# EAGLE board Apple ii SCSI VDEV2 (EAGLE 9.6.2), part 1 of 2
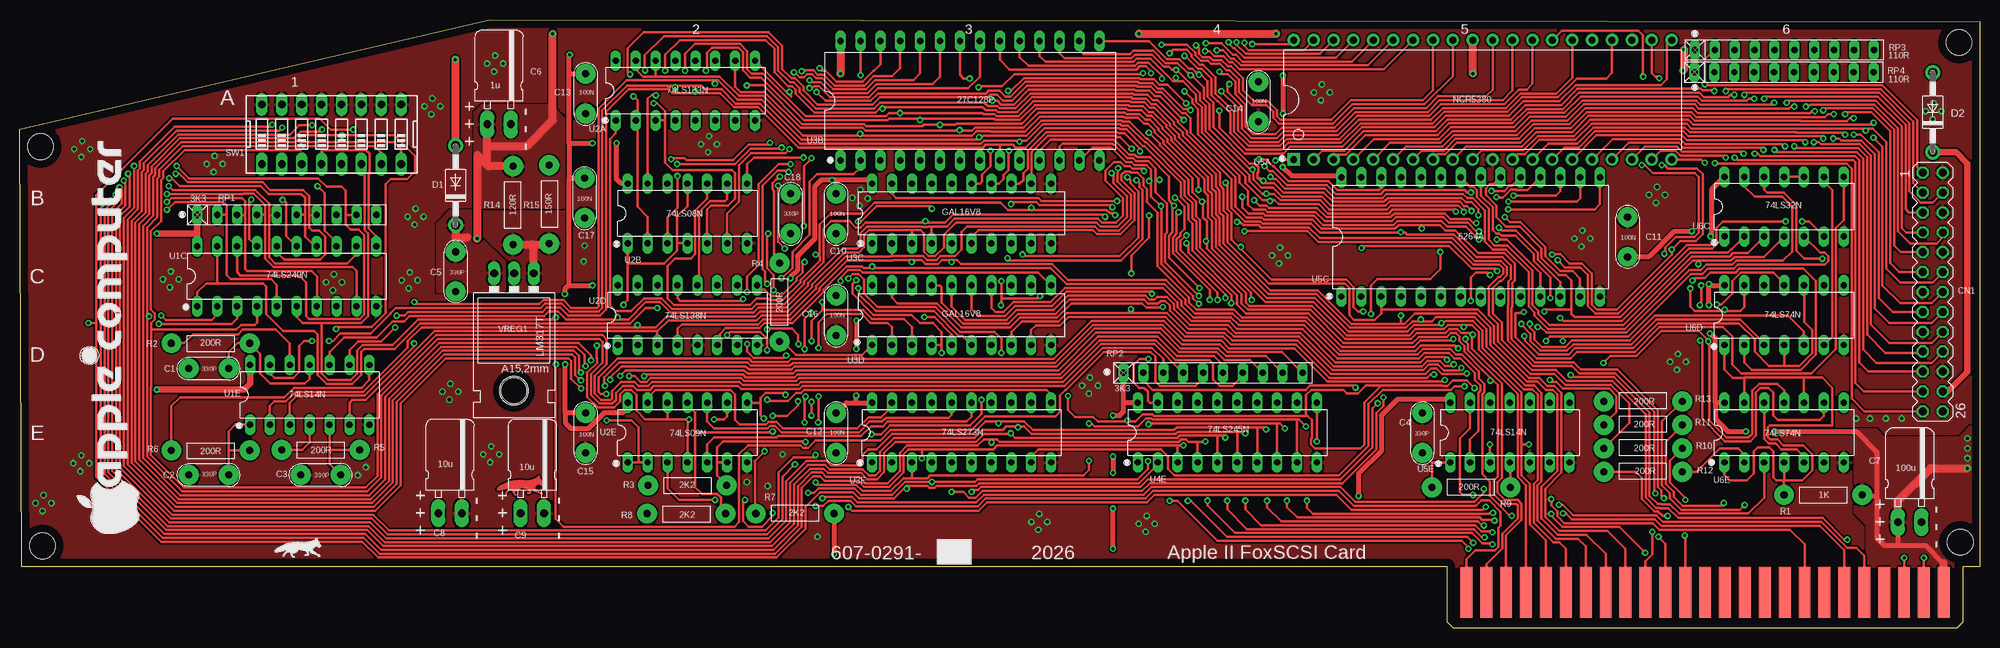
[diagram p2: board, top side]
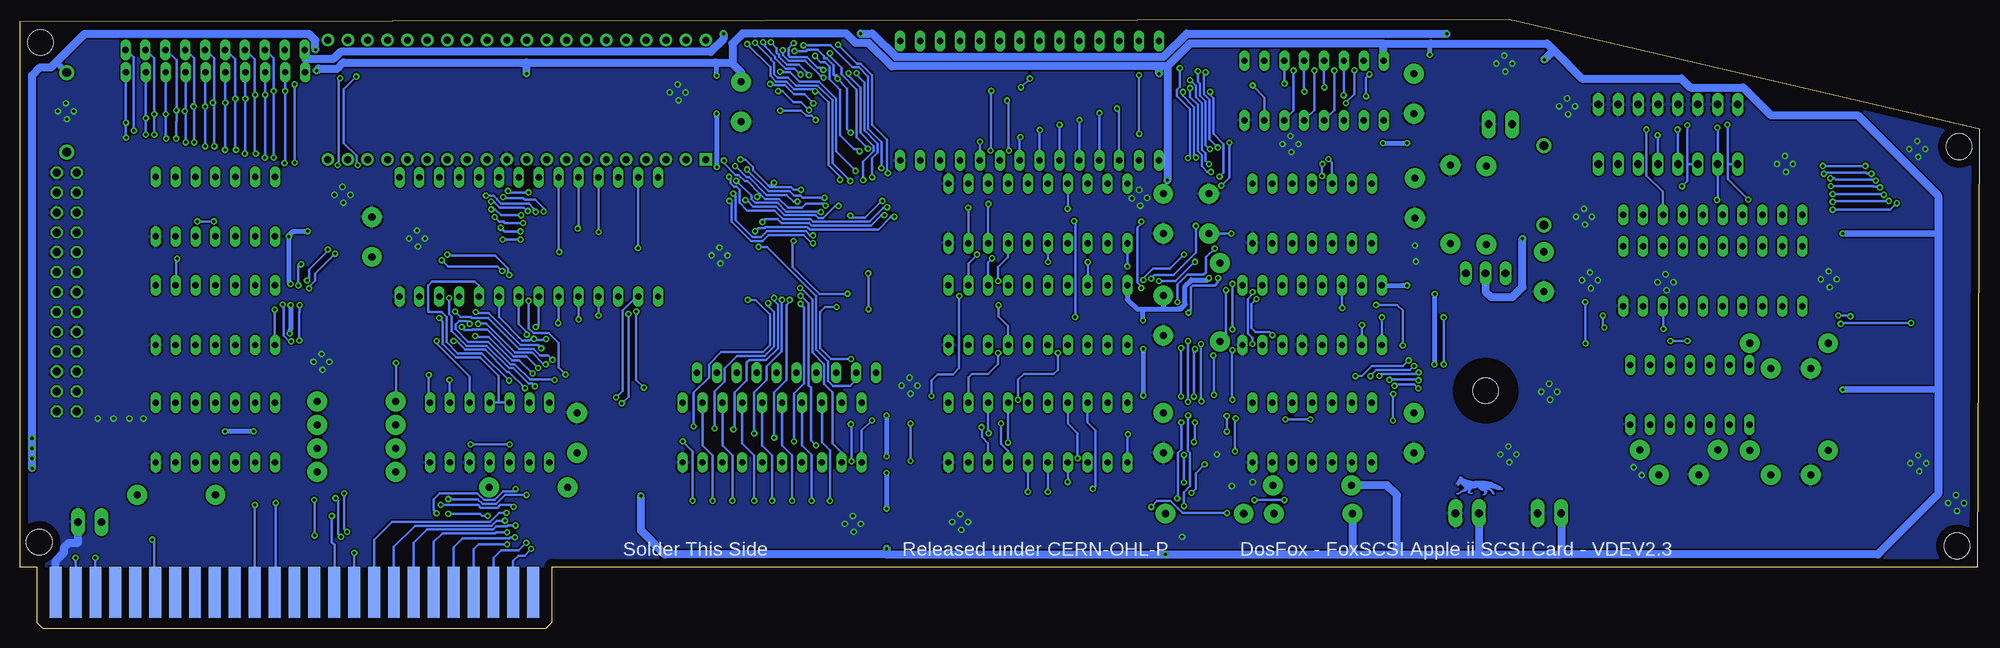
[diagram p3: board, bottom side, seen from below]

Size 250.25 x 77.75 mm. Coordinates in mm from the lower left corner, seen from the top.
Outline: 0.25,7.87 0,63.75 60,77.75 250.25,77.5 250.25,7.87 248.04,7.87 248.04,0.76 247.28,0 183.02,0 182.26,0.76 182.26,7.87 0.25,7.87
Copper layers (1*16): Top 0.035mm / dielectric 1.5mm / Bottom 0.035mm
Design rules "Fusion Electronics Design Rules *": minimum track width 8mil, minimum drill 15mil, track to track 0.187959375mm, track to pad 0.187959375mm, pad to pad 0.187959375mm, via to via 8mil, smd to smd 0.187959375mm, copper to edge 40mil, drill to drill 8mil, minimum pad ring 10mil, minimum via ring 8mil, stop-mask expansion 4mil, vias tented up to drill 15mil, thermal gap 10mil
Net classes: 1 thick: width 0.381 mm
Holes 3.3 mm at 2.68,61.53 2.92,10.54 247.59,74.84 247.75,11

## Footprints (pad centres in the part's own frame; a part is rotated, then mirrored left to right if it is on the bottom)
CAP_5.08MM_PITCH = drill 0.9 pad 2.54: P$1 0,0; P$2 0,-5.08
CAP_ELECTROLYTIC_FLAT = drill 1 pad 1.778 long: P$1 0,0; P$2 0,-3
MA13-2 = drill 1.016 octagon: 1 -15.24,-1.27; 2 -15.24,1.27; 3 -12.7,-1.27; 4 -12.7,1.27; 5 -10.16,-1.27; 6 -10.16,1.27; 7 -7.62,-1.27; 8 -7.62,1.27; 9 -5.08,-1.27; 10 -5.08,1.27; 11 -2.54,-1.27; 12 -2.54,1.27; 13 0,-1.27; 14 0,1.27; 15 2.54,-1.27; 16 2.54,1.27; 17 5.08,-1.27; 18 5.08,1.27; 19 7.62,-1.27; 20 7.62,1.27; 21 10.16,-1.27; 22 10.16,1.27; 23 12.7,-1.27; 24 12.7,1.27; 25 15.24,-1.27; 26 15.24,1.27
DO41-10 = drill 1.118 pad 1.93: A 5.08,0; C -5.08,0
RESISTORTHRUHOLE = drill 0.9 pad 2.54: P$1 0,0; P$2 10,0
RN-10 = drill 0.813 long: 1 -11.43,0; 2 -8.89,0; 3 -6.35,0; 4 -3.81,0; 5 -1.27,0; 6 1.27,0; 7 3.81,0; 8 6.35,0; 9 8.89,0; 10 11.43,0
A2-50PIN-MINI = smd 1.524 x 6.477: 01 27.435,-29.845; 02 29.975,-29.845; 03 32.515,-29.845; 04 35.055,-29.845; 05 37.595,-29.845; 06 40.135,-29.845; 07 42.675,-29.845; 08 45.215,-29.845; 09 47.755,-29.845; 10 50.295,-29.845; 11 52.835,-29.845; 12 55.375,-29.845; 13 57.915,-29.845; 14 60.455,-29.845; 15 62.995,-29.845; 16 65.535,-29.845; 17 68.075,-29.845; 18 70.615,-29.845; 19 73.155,-29.845; 20 75.695,-29.845; 21 78.235,-29.845; 22 80.775,-29.845; 23 83.315,-29.845; 24 85.855,-29.845; 25 88.395,-29.845 | smd 1.524 x 6.477 bottom: 26 88.395,-29.845; 27 85.855,-29.845; 28 83.315,-29.845; 29 80.775,-29.845; 30 78.235,-29.845; 31 75.695,-29.845; 32 73.155,-29.845; 33 70.615,-29.845; 34 68.075,-29.845; 35 65.535,-29.845; 36 62.995,-29.845; 37 60.455,-29.845; 38 57.915,-29.845; 39 55.375,-29.845; 40 52.835,-29.845; 41 50.295,-29.845; 42 47.755,-29.845; 43 45.215,-29.845; 44 42.675,-29.845; 45 40.135,-29.845; 46 37.595,-29.845; 47 35.055,-29.845; 48 32.515,-29.845; 49 29.975,-29.845; 50 27.435,-29.845
DIPSWITCH-08 = drill 0.97 long: 1 -8.89,-3.81; 2 -6.35,-3.81; 3 -3.81,-3.81; 4 -1.27,-3.81; 5 1.27,-3.81; 6 3.81,-3.81; 7 6.35,-3.81; 8 8.89,-3.81; 9 8.89,3.81; 10 6.35,3.81; 11 3.81,3.81; 12 1.27,3.81; 13 -1.27,3.81; 14 -3.81,3.81; 15 -6.35,3.81; 16 -8.89,3.81
DIL20 = drill 0.813 long: 1 -11.43,-3.81; 2 -8.89,-3.81; 3 -6.35,-3.81; 4 -3.81,-3.81; 5 -1.27,-3.81; 6 1.27,-3.81; 7 3.81,-3.81; 8 6.35,-3.81; 9 8.89,-3.81; 10 11.43,-3.81; 11 11.43,3.81; 12 8.89,3.81; 13 6.35,3.81; 14 3.81,3.81; 15 1.27,3.81; 16 -1.27,3.81; 17 -3.81,3.81; 18 -6.35,3.81; 19 -8.89,3.81; 20 -11.43,3.81
DIL14 = drill 0.813 long: 1 -7.62,-3.81; 2 -5.08,-3.81; 3 -2.54,-3.81; 4 0,-3.81; 5 2.54,-3.81; 6 5.08,-3.81; 7 7.62,-3.81; 8 7.62,3.81; 9 5.08,3.81; 10 2.54,3.81; 11 0,3.81; 12 -2.54,3.81; 13 -5.08,3.81; 14 -7.62,3.81
DIL16 = drill 0.813 long: 1 -8.89,-3.81; 2 -6.35,-3.81; 3 -3.81,-3.81; 4 -1.27,-3.81; 5 1.27,-3.81; 6 3.81,-3.81; 7 6.35,-3.81; 8 8.89,-3.81; 9 8.89,3.81; 10 6.35,3.81; 11 3.81,3.81; 12 1.27,3.81; 13 -1.27,3.81; 14 -3.81,3.81; 15 -6.35,3.81; 16 -8.89,3.81
DIL28-6 = drill 0.813 long: 1 -16.51,-7.62; 2 -13.97,-7.62; 3 -11.43,-7.62; 4 -8.89,-7.62; 5 -6.35,-7.62; 6 -3.81,-7.62; 7 -1.27,-7.62; 8 1.27,-7.62; 9 3.81,-7.62; 10 6.35,-7.62; 11 8.89,-7.62; 12 11.43,-7.62; 13 13.97,-7.62; 14 16.51,-7.62; 15 16.51,7.62; 16 13.97,7.62; 17 11.43,7.62; 18 8.89,7.62; 19 6.35,7.62; 20 3.81,7.62; 21 1.27,7.62; 22 -1.27,7.62; 23 -3.81,7.62; 24 -6.35,7.62; 25 -8.89,7.62; 26 -11.43,7.62; 27 -13.97,7.62; 28 -16.51,7.62
DIP40 = drill 0.889 pad 1.6 square: 1 -22.86,-7.62 | drill 0.889 pad 1.6: 2 -20.32,-7.62; 3 -17.78,-7.62; 4 -15.24,-7.62; 5 -12.7,-7.62; 6 -10.16,-7.62; 7 -7.62,-7.62; 8 -5.08,-7.62; 9 -2.54,-7.62; 10 0,-7.62; 11 2.54,-7.62; 12 5.08,-7.62; 13 7.62,-7.62; 14 10.16,-7.62; 15 12.7,-7.62; 16 15.24,-7.62; 17 17.78,-7.62; 18 20.32,-7.62; 19 22.86,-7.62; 20 25.4,-7.62; 21 25.4,7.62; 22 22.86,7.62; 23 20.32,7.62; 24 17.78,7.62; 25 15.24,7.62; 26 12.7,7.62; 27 10.16,7.62; 28 7.62,7.62; 29 5.08,7.62; 30 2.54,7.62; 31 0,7.62; 32 -2.54,7.62; 33 -5.08,7.62; 34 -7.62,7.62; 35 -10.16,7.62; 36 -12.7,7.62; 37 -15.24,7.62; 38 -17.78,7.62; 39 -20.32,7.62; 40 -22.86,7.62
317TL = drill 1.016 long: 1 -2.54,-3.81; 2 0,-3.81; 3 2.54,-3.81 | hole 3.302: 0,11.176

## Placement (x,y rotation side)
C1  330p 100V  [CAP_5.08MM_PITCH]  21.61,33.17 90 top
C2  330p 100V  [CAP_5.08MM_PITCH]  21.61,19.59 90 top
C3  330p 100V  [CAP_5.08MM_PITCH]  35.91,19.59 90 top
C4  330p 100V  [CAP_5.08MM_PITCH]  179.1,27.5 0 top
C5  330p 50V  [CAP_5.08MM_PITCH]  55.69,43.01 180 top
C6  1u 50V  [CAP_ELECTROLYTIC_FLAT]  59.71,64.38 90 top
C7  3102-100U  [CAP_ELECTROLYTIC_FLAT]  239.8,13.57 90 top
C8  [CAP_ELECTROLYTIC_FLAT]  53.45,14.7 90 top
C9  [CAP_ELECTROLYTIC_FLAT]  63.95,14.7 90 top
C10  100n 50V  [CAP_5.08MM_PITCH]  104.25,55.5 0 top
C11  100n 50V  [CAP_5.08MM_PITCH]  205.28,47.45 180 top
C12  100n 50V  [CAP_5.08MM_PITCH]  104.25,27.5 0 top
C13  100n 50V  [CAP_5.08MM_PITCH]  72.25,70.82 0 top
C14  100n 50V  [CAP_5.08MM_PITCH]  158.13,69.79 0 top
C15  100n 50V  [CAP_5.08MM_PITCH]  72.25,27.5 0 top
C16  100n 50V  [CAP_5.08MM_PITCH]  104.25,42.5 0 top
C17  100n 50V  [CAP_5.08MM_PITCH]  72.13,57.5 0 top
C18  330p 100V  [CAP_5.08MM_PITCH]  98.44,55.5 0 top
CN1  [MA13-2]  244.25,42.96 270 top
D1  1N4004  [DO41-10]  55.66,56.57 90 top
D2  1N4004  [DO41-10]  244.22,65.91 90 top
R1  1k  [RESISTORTHRUHOLE]  225.25,17.05 0 top
R2  200R  [RESISTORTHRUHOLE]  19.38,36.41 0 top
R3  2k2  [RESISTORTHRUHOLE]  80.25,18.28 0 top
R4  200R  [RESISTORTHRUHOLE]  97.04,46.66 270 top
R5  200R  [RESISTORTHRUHOLE]  33.43,22.79 0 top
R6  200R  [RESISTORTHRUHOLE]  19.38,22.71 0 top
R7  2k2  [RESISTORTHRUHOLE]  103.98,14.65 180 top
R8  2k2  [RESISTORTHRUHOLE]  80.13,14.65 0 top
R9  200R  [RESISTORTHRUHOLE]  190.29,18 180 top
R10  200R  [RESISTORTHRUHOLE]  212.25,23 180 top
R11  200R  [RESISTORTHRUHOLE]  212.25,26 180 top
R12  200R  [RESISTORTHRUHOLE]  212.25,20 180 top
R13  200R  [RESISTORTHRUHOLE]  212.25,29 180 top
R14  120R  [RESISTORTHRUHOLE]  62.99,59.03 270 top
R15  150R  [RESISTORTHRUHOLE]  67.61,49.16 90 top
RP1  3K3  [RN-10]  34.11,52.81 0 top
RP2  3K3  [RN-10]  152.35,32.63 0 top
RP3  100R  [RN-10]  225.3,73.87 0 top
RP4  100R  [RN-10]  225.25,71.04 0 top
ST1  [A2-50PIN-MINI]  157.25,34.45 0 top
SW1  [DIPSWITCH-08]  39.83,63.1 0 top
U1C  74LS240N  [DIL20]  34.11,44.97 0 top
U1E  74LS14N  [DIL14]  37.03,29.83 0 top
U2A  74LS133N  [DIL16]  85,68.69 0 top
U2B  74LS08N  [DIL14]  85.25,53 0 top
U2D  74LS138N  [DIL16]  85.25,40 0 top
U2E  74LS09N  [DIL14]  85.25,25 0 top
U3B  27C128P  [DIL28-6]  121.32,67.38 0 top
U3C  GAL16V8  [DIL20]  120.25,53 0 top
U3D  GAL16V8  [DIL20]  120.25,40 0 top
U3E  74LS273N  [DIL20]  120.25,25 0 top
U4E  74LS245N  [DIL20]  154.19,25 0 top
U5A  NCR5380  [DIP40]  185.51,67.5 0 top
U5C  6264A  [DIL28-6]  185.25,50 0 top
U5E  74LS14N  [DIL14]  190.25,25 0 top
U6C  74LS32N  [DIL14]  225.25,53.86 0 top
U6D  74LS74N  [DIL14]  225.25,40 0 top
U6E  74LS74N  [DIL14]  225.25,25 0 top
VREG1  LM317T  [317TL]  63.11,41.54 180 top

## Tracks (layer width: path | path; a pad name or v marks a point on that pad's centre or on a via)
00  (via drill 0.38 pad 0.8)
  Top 0.305: R12.P$2 206.31,20 207.07,19.25 207.07,16.55 208.7,14.91 209.14,14.91 209.21,14.84 209.25,14.84 209.75,14.35 v210.4,14.35
  Bottom 0.305: ST1.40 210.06,4.64 210.06,10.67 210.4,11.01 v210.4,14.35
7M  (via drill 0.38 pad 0.8)
  Top 0.305: R13.P$1 209.66,26.4 209.66,18.24 210.68,17.22 210.68,16.59 212.12,15.15 219.62,15.15 v220.22,15.75
  Bottom 0.305: v220.22,15.75 220.22,2.92 220.34,2.79 220.34,4.51 ST1.36
+2V85  (via drill 0.38, 0.38 pad 0.8)
  Top 1.016: 59.71,59.18 59.71,61.47 | 59.71,61.47 C6.P$1 | R14.P$1 59.86,59.03 59.71,59.18 | 59.71,59.18 58.44,60.45 58.44,49.8 v58.4,49.76 | 59.71,61.47 59.84,61.59 64.77,61.59 68.07,64.9 v68.07,75.95 | RP3.1 213.87,71.09 RP4.1 | v142.88,75.95 142.91,75.98 160.4,75.98 v160.4,75.95
  Bottom 1.016: v68.07,75.95 69.6,75.95 101.25,75.98 104.25,72.98 138.39,72.98 141.38,75.98 142.84,75.98 v142.88,75.95 | RP3.1 213.84,73.84 213.84,72.82 213.73,72.71 210.19,72.71 209.28,73.62 162.03,73.62 160.4,75.25 v160.4,75.95 | VREG1.2 63.11,43.04 62.36,42.29 59.69,42.29 58.4,43.58 v58.4,49.76
  pour Top: 58.12,53.8 69.77,53.8 69.77,64.87 67.91,66.73 58.96,66.73 58.12,65.88
+5V  (via drill 0.38, 0.38 pad 0.8, 0.4 pad 0.8)
  Top 0.61: 239.78,10.54 238.12,10.54 237.11,11.56 237.11,16.89 | C7.P$1 239.8,10.56 239.78,10.54 | 239.78,10.54 243.39,10.54 245.6,8.33 | v139.57,10.18 v139.57,15.29 | 215.77,43.81 215.66,43.81 v215.66,41.27 | 215.77,43.81 U6D.14 | U6E.14 216.48,28.81 | 216.48,28.81 216.48,26.72 218.06,25.15 v220.4,25.15 | v224.03,25.15 234.44,25.15 237.11,22.48 237.11,16.89 | R1.P$2 235.41,16.89 237.11,16.89 | 70.14,57.5 C17.P$1 | U2B.14 76.79,56.81 76.2,57.4 v76.2,61.98 | 70.14,43.89 70.14,43.81 v73.13,43.81 | 70.14,43.89 70.14,57.5 | 70.14,61.98 70.14,57.5 | 70.14,61.98 70.14,70.82 | 70.14,70.82 C13.P$1 | U2E.14 77.63,28.18 77.02,27.56 74.66,27.56 72.63,25.53 70.36,25.53 69.65,26.24 69.65,27.56 | v139.57,27.18 140.42,27.18 140.92,27.68 140.92,28.83 | 140.92,28.83 RP2.1 | 69.65,27.56 v69.65,33.73 | U5E.14 182.18,29.26 175.91,29.26 173.83,27.18 173.83,22.61 170.94,19.73 v170.94,16.89 | v139.57,21.97 v139.57,19.84 | 216.48,28.81 216.48,37.04 215.85,37.67 v215.77,37.67 | 215.77,43.81 215.77,43.87 v215.67,43.97 | U6C.14 215.99,56.02 215.99,50.17 v215.88,50.06 | 70.14,70.82 70.14,73.19 v70.23,73.28 | 70.14,61.98 v73.13,61.98 | 70.14,43.89 69.6,43.34 v69.6,42.71 | U3C.20 108.4,57.24 104.27,57.24 | 104.27,57.24 v103.74,57.24 102.34,57.24 101.51,56.4 101.51,49.73 99.29,47.52 99.29,45.72 98.44,44.87 v98.44,44.71 | C11.P$1 207.98,47.45 211.2,50.67 213.45,50.67 v213.49,50.71 | U5C.28 168.59,57.78 162.39,57.78 v161.25,58.93 | C15.P$1 69.71,27.5 69.65,27.56 | v161.29,70.61 v161.29,65.72 | R7.P$1 v103.98,9.45 | C12.P$1 105.56,28.81 106.81,28.81 | 106.81,28.81 U3E.20 | 106.81,28.81 v106.81,29.72 | v106.85,39.32 106.83,39.3 106.83,35.71 v106.81,35.69
  Top 0.61: U4E.20 140.94,28.81 140.92,28.83 | C10.P$1 104.25,57.22 104.27,57.24
  Top 0.813: RP1.1 22.68,50.42 | 22.68,50.42 U1C.20 | 22.68,50.42 v17.53,50.42 | U1E.14 29.44,33.61 29.44,31.26 28.67,30.48 v17.53,30.48
  Top 1.016: 245.6,8.33 245.6,4.66 ST1.25 | D1.A 55.66,72.61 v55.63,72.64 | C7.P$1 239.8,16.28 243.97,20.45 v248.67,20.45 | U5A.31 185.51,70.91 v185.55,70.87 | U3B.28 104.81,70.9 v104.78,70.87 | v212.34,71.25 212.46,71.36 212.46,72.26 212.47,72.27 v212.47,73.91
  Bottom 0.61: U3D.20 108.82,42.02 107.57,40.77 106.85,40.77 | 106.85,40.77 104.14,40.77 | 104.14,40.77 102.36,40.77 102.34,40.79 102.05,40.79 101.47,41.37 101.47,43.71 100.67,44.52 98.63,44.52 v98.44,44.71 | C16.P$1 104.25,40.88 104.14,40.77 | U2D.16 73.67,43.81 73.66,43.81 v73.13,43.81 | v139.57,27.18 v139.57,21.97 | v220.4,25.15 v224.03,25.15 | v69.6,42.71 69.65,42.66 v69.65,33.73 | v139.57,19.84 v139.57,15.29 | v215.77,37.67 215.77,38.03 215.66,38.14 v215.66,41.27 | v215.67,43.97 215.88,44.18 v215.88,50.06 215.88,50.19 215.39,50.67 213.53,50.67 v213.49,50.71 | v70.23,73.28 70.23,74.55 70.1,74.68 | v76.2,61.98 v73.13,61.98 | v161.25,58.93 161.25,65.36 161.29,65.41 v161.29,65.72 | v161.29,70.61 161.29,72.14 161.42,72.26 | v106.81,29.72 v106.81,35.69 | v106.85,39.32 106.85,40.77
  Bottom 0.813: v17.53,50.42 5.46,50.42 5.33,50.55 | v17.53,30.48 5.33,30.48 | 245.55,72.33 D2.A
  Bottom 1.016: v139.57,10.18 139.57,9.45 | 139.57,9.45 v103.98,9.45 80.26,9.45 | 80.26,9.45 74.42,9.45 | v170.94,16.89 170.94,12.5 167.89,9.45 139.57,9.45 | 74.42,9.45 74.42,17.02 75.68,18.28 R3.P$1 | R8.P$1 80.13,9.59 80.26,9.45 | 74.42,9.45 63.75,9.45 | 63.75,9.45 53.59,9.45 | v248.67,20.45 v248.67,21.72 v248.67,22.99 v248.67,24.26 248.67,70.61 247.61,71.66 246.22,71.66 245.55,72.33 242,75.89 213.31,75.89 212.51,75.09 212.51,73.95 v212.47,73.91 | v212.34,71.25 212.09,71.5 209.68,71.5 208.91,72.26 185.55,72.26 | 185.55,72.26 161.42,72.26 159.38,72.26 | 159.38,72.26 159.26,72.26 159.26,74.69 157.97,75.98 144.71,75.98 143.48,74.74 141.85,74.74 138.89,71.78 104.78,71.78 | 159.38,72.26 158.13,71 C14.P$1 | v185.55,70.87 185.55,72.26 | U2A.16 76.15,72.54 76.15,74.68 | 76.15,74.68 100.85,74.68 103.75,71.78 | 103.75,71.78 104.78,71.78 | v104.78,70.87 104.78,71.78 | 76.15,74.68 70.1,74.68 55.24,74.68 54.36,73.79 | 54.36,73.79 50.8,70.23 38.1,70.23 36.95,69.08 30.22,69.08 26.67,65.53 15.62,65.53 5.33,55.24 5.33,50.55 5.33,30.48 5.33,17.14 13.03,9.45 53.59,9.45 | v55.63,72.64 54.48,73.79 54.36,73.79 | 103.75,71.78 103.75,59.69 | 103.75,59.69 103.75,57.25 v103.74,57.24 | 103.75,59.69 103.82,59.76 U3B.1 | C9.P$1 63.95,9.65 63.75,9.45 | 53.59,9.45 53.45,9.59 C8.P$1
  pour Top: 235.76,13.27 235.79,13.2 235.79,7.93 250.11,7.93 250.11,25.96 249.21,25.96 247.59,24.34 247.51,24.31 238.14,24.31 238.06,24.34 237.08,25.32 234.26,25.32 234.26,19.96 234.26,19.92 234.26,19.92 234.26,19.92 234.25,19.9 234.25,14.78
/ACK  (via drill 0.38 pad 0.8)
  Top 0.305: v230.24,66.16 230.5,66.42 236.58,66.42 239.29,63.71 239.29,48.87 240.13,48.04 CN1.9 | v230.25,62.57 229.99,62.83 226.61,62.83 226.6,62.85 213.03,62.85 212.4,63.48 201.11,63.48 199.04,61.41 197.2,61.41 U5A.14
  Bottom 0.305: 230.2,66.16 230.2,64.69 230.25,64.64 v230.25,62.57 | 230.2,66.16 v230.24,66.16 | RP3.8 231.53,73.87 230.2,72.54 230.2,66.16
/ATN  (via drill 0.38 pad 0.8)
  Top 0.305: CN1.8 245.52,49.94 244.73,49.15 241.36,49.15 239.79,50.73 239.79,63.91 236.79,66.92 228.61,66.92 228.35,66.65 v228.05,66.65 | v227.97,62.08 227.7,62.34 226.41,62.34 226.39,62.36 212.83,62.36 212.2,62.99 201.32,62.99 U5A.15
  Bottom 0.305: 227.97,66.61 227.97,72.85 228.99,73.87 RP3.7 | 227.97,66.61 v227.97,62.08 | 227.97,66.61 228,66.65 v228.05,66.65
/BSY  (via drill 0.38 pad 0.8)
  Top 0.305: v233.04,65.67 233.31,65.93 236.38,65.93 238.8,63.51 238.8,46.63 239.93,45.5 CN1.11 | U5A.13 195.15,61.91 198.84,61.91 200.91,63.98 212.6,63.98 213.24,63.34 226.8,63.34 226.82,63.33 232.78,63.33 v233.04,63.06
  Bottom 0.305: RP3.9 234.07,73.87 233.04,72.85 v233.04,65.67 233.04,63.54 v233.04,63.06
/CD  (via drill 0.38 pad 0.8)
  Top 0.305: CN1.4 244.22,54.36 242.72,54.36 241.27,55.81 241.27,64.53 237.4,68.39 220.43,68.39 v220.17,68.13 | v220.09,60.62 219.83,60.88 212.22,60.88 211.58,61.51 207.46,61.51 U5A.18
  Bottom 0.305: 220.22,68.42 220.22,72.72 221.37,73.87 RP3.4 | 220.22,68.42 220.22,60.74 v220.09,60.62 | 220.22,68.42 220.17,68.36 v220.17,68.13
/DB0  (via drill 0.38 pad 0.8)
  Top 0.305: v234.14,65.17 233.62,65.17 233.25,64.81 227.43,64.81 227.41,64.82 213.85,64.82 213.22,65.45 200.3,65.45 198.23,63.38 193.62,63.38 191.78,61.54 184.63,61.54 U5A.9 | CN1.15 239.11,40.42 237.32,42.21 237.32,60.8 235.06,63.06 v234.16,63.06
  Bottom 0.305: RP4.9 v234.14,65.17 234.14,63.64 234.16,63.61 v234.16,63.06
/DB1  (via drill 0.38 pad 0.8)
  Top 0.305: CN1.16 244.09,38.99 238.69,38.99 236.83,40.85 236.83,60.59 235.12,62.31 232.55,62.31 232.28,62.57 v231.52,62.57 | v231.6,65.66 230.81,65.66 230.45,65.3 227.64,65.3 227.62,65.31 214.05,65.31 213.42,65.95 200.09,65.95 198.02,63.88 193.42,63.88 191.58,62.03 183.51,62.03 182.01,60.54 181.09,60.54 U5A.8
  Bottom 0.305: RP4.8 v231.6,65.66 231.6,63.03 231.52,62.96 v231.52,62.57
/DB2  (via drill 0.38 pad 0.8)
  Top 0.305: CN1.18 244.09,36.45 238.7,36.45 236.34,38.81 236.34,60.39 234.91,61.81 229.94,61.81 229.67,62.08 v229.04,62.08 | v229.17,66.05 228.82,66.05 228.57,65.81 214.26,65.81 213.63,66.44 199.89,66.44 197.82,64.37 193.22,64.37 191.37,62.52 183.3,62.52 181.81,61.03 179.04,61.03 U5A.7
  Bottom 0.305: 229.06,66.17 RP4.7 | 229.06,66.17 229.06,62.91 229.04,62.9 v229.04,62.08 | 229.06,66.17 v229.17,66.05
/DB3  (via drill 0.38 pad 0.8)
  Top 0.305: CN1.19 242.82,35.18 238.18,35.18 235.85,37.52 235.85,60.19 234.73,61.3 226.83,61.3 v226.57,61.57 | v226.57,66.65 226.15,66.65 225.89,66.39 214.37,66.39 213.83,66.93 199.69,66.93 197.61,64.86 193.01,64.86 191.17,63.02 183.1,63.02 181.6,61.52 176.99,61.52 U5A.6
  Bottom 0.305: RP4.6 226.57,70.99 v226.57,66.65 v226.57,61.57
/DB4  (via drill 0.38 pad 0.8)
  Top 0.305: CN1.20 244.09,33.91 237.05,33.91 235.35,35.6 235.35,59.98 234.53,60.81 224.33,60.81 v224.03,61.11 | v223.98,67.14 223.71,66.88 214.58,66.88 214.03,67.43 199.48,67.43 197.41,65.35 192.81,65.35 190.96,63.51 182.89,63.51 181.4,62.02 174.94,62.02 U5A.5
  Bottom 0.305: RP4.5 v223.98,67.14 223.98,61.16 v224.03,61.11
/DB5  (via drill 0.38 pad 0.8)
  Top 0.305: v221.49,60.62 221.89,60.62 222.19,60.31 234.32,60.31 234.86,59.78 234.86,33.96 236.02,32.8 CN1.21 | v221.44,67.64 220.74,67.64 220.48,67.38 214.78,67.38 214.24,67.92 199.28,67.92 197.21,65.85 192.6,65.85 190.76,64 182.69,64 181.2,62.51 172.9,62.51 U5A.4
  Bottom 0.305: RP4.4 v221.44,67.64 221.44,60.67 v221.49,60.62
/DB6  (via drill 0.38 pad 0.8)
  Top 0.305: v218.95,60.12 219.03,60.12 219.33,59.82 234.12,59.82 234.37,59.57 234.37,31.34 235.45,30.26 CN1.23 | v218.9,68.13 218.38,68.13 218.12,67.87 214.99,67.87 214.44,68.41 199.07,68.41 197,66.34 192.4,66.34 190.56,64.5 182.49,64.5 180.99,63 171.78,63 169.3,60.53 168.38,60.53 U5A.3
  Bottom 0.305: RP4.3 v218.9,68.13 218.9,60.37 218.95,60.31 v218.95,60.12
/DB7  (via drill 0.38 pad 0.8)
  Top 0.305: v216.36,68.62 216.27,68.71 214.84,68.71 214.65,68.91 198.87,68.91 196.8,66.83 192.2,66.83 190.35,64.99 182.28,64.99 180.79,63.49 171.57,63.49 169.1,61.02 166.33,61.02 U5A.2 | v216.43,59.43 216.54,59.33 233.29,59.33 233.88,58.74 233.88,29.36 235.52,27.72 CN1.25
  Bottom 0.305: RP4.2 v216.36,68.62 216.36,59.51 v216.43,59.43
/DBP  (via drill 0.38 pad 0.8)
  Top 0.305: CN1.14 244.09,41.53 240.09,41.53 237.82,43.81 237.82,61.52 v236.66,62.67 | U5A.10 186.67,61.05 191.98,61.05 193.83,62.89 198.43,62.89 200.5,64.96 213.01,64.96 213.65,64.33 227.21,64.33 227.23,64.31 236.42,64.31 v236.68,64.56
  Bottom 0.305: 236.68,64.26 RP4.10 | 236.68,64.26 236.68,62.69 v236.66,62.67 | v236.68,64.56 236.68,64.26
/DEVSEL  (via drill 0.38 pad 0.8)
  Top 0.305: U2D.4 83.98,38.27 84.55,38.84 94.29,38.84 94.92,39.47 98.44,39.47 102.15,43.17 102.15,43.49 105.64,46.98 111.43,46.98 111.49,47.04 113.92,47.04 | v190.49,14.36 190.26,14.36 187.7,16.93 187.7,18.72 186.71,19.7 186.71,29.89 187,30.17 187,31.2 186.27,31.93 186.27,32.81 184.11,34.97 183.37,34.97 182.69,35.66 179.12,35.66 178.41,34.95 168.41,34.95 164.14,39.22 155.84,39.22 154.85,40.21 150.03,40.21 148.82,41.42 148.82,42.03 146.37,44.47 133.84,44.47 131.8,46.51 120.19,46.51 119.66,47.04 118.96,47.04 | 113.92,47.04 115.13,47.04 115.62,46.54 117.27,46.54 117.76,47.04 118.96,47.04 | 118.96,47.04 v118.96,46.77 | v195.53,14.61 195.53,14.36 196.95,12.94 204.23,12.94 v207.52,9.65 | v113.89,46.77 113.89,47 113.92,47.04
  Bottom 0.305: v207.52,9.65 207.52,4.64 ST1.41 | v190.49,14.36 191.22,14.36 191.47,14.61 v195.53,14.61 | U3C.5 118.98,47.24 118.96,47.21 v118.96,46.77 | U3D.18 113.9,43.74 113.89,43.73 v113.89,46.77
/IO  (via drill 0.38 pad 0.8)
  Top 0.305: v222.63,61.11 222.37,61.37 212.42,61.37 211.79,62.01 205.41,62.01 U5A.17 | v222.71,67.64 222.71,67.81 222.8,67.9 237.19,67.9 240.77,64.32 240.77,53.55 241.2,53.12 CN1.5
  Bottom 0.305: 222.71,67.77 222.71,72.67 223.91,73.87 RP3.5 | 222.71,67.77 222.71,61.19 v222.63,61.11 | v222.71,67.64 222.71,67.77
/IOSELECT  (via drill 0.38, 0.38 pad 0.8)
  Top 0.305: ST1.01 184.69,8.82 185.85,9.98 188.34,9.98 188.78,10.43 188.78,12.82 189.05,13.1 189.05,14.87 187.6,16.32 186.62,16.32 185.94,15.64 170.35,15.64 168.43,17.56 144.69,17.56 143.7,16.57 123.32,16.57 122.33,15.59 106.78,15.59 106.06,16.3 103.26,16.3 102.57,15.62 v101.62,15.62 | U3D.3 113.9,38.5 112.88,39.52 108.83,39.52 107.68,40.67 102.51,40.67 | v101.1,28.95 101.1,27.2 v101.08,27.18 | 102.51,40.67 102.48,40.67 101.09,39.28 v101.09,36.68 | v95.8,62.04 95.54,61.78 93.09,61.78 91.11,59.8 85.13,59.8 84.86,60.07 83.3,60.07 v83.17,59.94 | v96.85,56.55 96.85,56.43 96.83,56.41 96.83,49.39 v97.69,48.52 | v102.42,41.69 102.51,41.6 102.51,40.67
  Bottom 0.305: v101.08,27.18 101.09,27.16 101.09,22.68 100.84,22.43 100.84,18.17 101.62,17.39 v101.62,15.62 | v101.09,36.68 101.1,36.67 v101.1,28.95 | v95.8,62.04 95.81,62.03 95.81,57.6 v96.85,56.55 | v83.17,59.94 82.71,59.49 U2B.12 | v102.42,41.69 102.42,43.91 101.17,45.16 99.11,45.16 98.81,45.47 98.81,47.4 v97.69,48.52
/IOSTROBE  (via drill 0.38 pad 0.8)
  Top 0.305: v101.98,29.61 101.98,26.32 v101.95,26.29 | ST1.20 232.95,9.94 229.79,13.1 209.56,13.1 208.73,13.92 198.17,13.92 197.41,14.68 v197.04,14.68 | v186.94,17.79 186.94,17.34 185.74,16.14 170.55,16.14 168.64,18.05 144.48,18.05 143.5,17.07 123.11,17.07 122.13,16.08 106.98,16.08 106.26,16.8 102.68,16.8 v102.49,16.61 | v101.97,35.8 101.97,39.06 103.03,40.13 107.53,40.13 108.62,39.03 110.81,39.03 111.36,38.48 U3D.2
  Bottom 0.305: v101.95,26.29 101.95,22.84 102.36,22.43 102.36,16.74 v102.49,16.61 | v101.98,29.61 101.98,35.79 v101.97,35.8 | v186.94,17.79 187.21,17.52 188.5,17.52 189.63,16.39 190.96,16.39 191.83,17.26 196.62,17.26 197.38,16.5 197.38,15.09 197.04,14.75 v197.04,14.68
/MSG  (via drill 0.38 pad 0.8)
  Top 0.305: CN1.3 241.76,56.88 241.76,64.73 237.6,68.89 218.07,68.89 v217.8,68.62 | v217.8,60.12 217.54,60.39 212.01,60.39 211.38,61.02 209.51,61.02 U5A.19
  Bottom 0.305: v217.8,60.12 v217.8,68.62 217.8,72.85 218.83,73.87 RP3.3
/REQ  (via drill 0.38 pad 0.8)
  Top 0.305: CN1.1 242.25,58.93 242.25,64.94 237.81,69.38 215.96,69.38 215.92,69.34 215.14,69.34 v215.14,69.46 | v215.14,69.46 215.14,72.72 216.29,73.87 RP3.2 | U5A.20 214.69,59.88 215.08,59.49 v215.14,59.49 | v215.14,69.46 v215.15,69.47
  Bottom 0.305: v215.15,69.47 v215.14,69.46 v215.14,59.49
/RESET  (via drill 0.38 pad 0.8)
  Top 0.305: U2B.10 87.79,54.9 86.26,53.36 86.26,47.77 85.73,47.24 83.69,47.24 82.73,46.28 82.73,42.1 83.53,41.3 93.27,41.3 94.07,42.1 95.58,42.1 95.75,41.93 97.42,41.93 99.68,44.19 99.68,44.51 102.16,46.98 102.16,47.45 102.15,47.45 102.15,47.75 | 129.16,53.45 v129.16,53.72 | 129.16,53.45 126.18,53.45 125.23,54.4 109.17,54.4 107.72,52.94 103.53,52.94 102.15,51.56 102.15,47.75 | 129.16,53.45 138.76,53.45 139.18,53.03 139.6,53.03 v139.85,52.78 | v155.44,51.91 155.81,51.91 156.23,51.48 158.2,51.48 158.46,51.22 164.62,51.22 166.01,49.83 182.9,49.83 185.79,46.93 189.11,46.93 189.88,46.16 189.88,45.12 189.15,44.39 189,44.39 188.06,43.45 188.06,40.2 189.22,39.05 189.22,36.83 193.05,33 196.12,33 197.52,31.6 203.33,31.6 207.58,27.34 207.58,16.73 208.91,15.4 209.34,15.4 209.41,15.34 210.47,15.34 211.73,14.08 230.2,14.08 232.95,11.33 v233.32,11.33 | U3D.4 117.72,36.2 | 117.72,36.2 117.72,37.85 116.59,38.99 114.93,38.99 113.88,40.04 109.01,40.04 106.31,42.73 106.31,43.99 v106.81,44.48 | 117.72,36.2 v117.72,35.17 | v122.8,29.2 122.8,27.38 121.33,25.91 111.09,25.91 109.97,24.79 v108.76,24.79 | v101.6,47.73 102.13,47.73 102.15,47.75
  Bottom 0.305: U3C.9 129.14,53.56 129.16,53.58 v129.16,53.72 | ST1.31 233.04,4.7 233.04,11.05 v233.32,11.33 | v139.85,52.78 140.22,52.78 141.57,51.44 149.17,51.44 149.5,51.77 152.99,51.77 153.46,52.24 155.1,52.24 v155.44,51.91 | v101.6,47.73 103.38,45.95 105.6,45.95 106.81,44.74 v106.81,44.48 | v117.72,35.17 117.72,33.03 118.24,32.51 122.05,32.51 122.8,31.76 v122.8,29.2 | v108.76,24.79 108.82,24.73 U3E.1
/RST  (via drill 0.38 pad 0.8)
  Top 0.305: v225.57,67.14 225.84,67.41 236.99,67.41 240.28,64.12 240.28,51.12 240.82,50.58 CN1.7 | v225.39,61.56 225.3,61.56 225,61.87 212.63,61.87 211.99,62.5 203.37,62.5 U5A.16
  Bottom 0.305: 225.42,67.44 225.42,72.85 226.45,73.87 RP3.6 | 225.42,67.44 225.57,67.29 v225.57,67.14 | 225.42,67.44 225.42,61.6 v225.39,61.56
/SEL  (via drill 0.38 pad 0.8)
  Top 0.305: CN1.12 244.22,44.2 240.1,44.2 238.31,45.98 238.31,62.08 236.59,63.81 235.53,63.81 | U5A.12 191.26,60.55 192.19,60.55 194.03,62.4 198.63,62.4 200.71,64.47 212.81,64.47 213.44,63.84 227.01,63.84 227.02,63.82 235.52,63.82 235.53,63.81 | 235.53,63.81 235.66,63.68 v235.66,63.56
  Bottom 0.305: RP3.10 236.61,73.87 235.66,72.92 v235.66,63.56
A0  (via drill 0.38 pad 0.8)
  Top 0.305: 187.96,31.82 188.72,31.06 188.72,19.39 188.19,18.87 188.19,17.13 189.42,15.9 191.04,15.9 191.25,15.69 191.25,14.05 189.28,12.08 189.28,10.22 187.23,8.17 ST1.02 | U1E.13 31.95,32.56 32.54,31.98 34.91,31.98 35.69,32.76 35.69,36.07 36.32,36.7 v37.32,36.7 | v39.5,36.7 40,36.7 40.95,37.65 44.81,37.65 47.38,40.22 47.38,40.25 48.04,40.91 66.55,40.91 67.1,41.46 69.22,41.46 70.23,40.45 73.91,40.45 74.38,40.91 74.38,66.19 77.52,69.33 83.69,69.33 | 83.69,69.33 87.05,69.33 87.54,68.84 89.62,68.84 91.43,67.03 94.51,67.03 99.62,61.91 122.76,61.91 123.12,62.28 127.64,62.28 | 83.69,69.33 v83.69,69.1 | 127.64,62.28 128.56,62.28 130.66,64.38 140.51,64.38 140.66,64.22 141.48,64.22 143.63,62.07 143.78,62.07 148.74,57.11 148.74,55.29 149.71,54.32 149.71,52.43 150.21,51.93 150.21,48.43 155.97,42.67 155.97,41.51 156.78,40.7 164.76,40.7 169.02,36.43 177.8,36.43 178.61,37.24 182.23,37.24 182.72,37.72 183.34,37.72 183.79,37.27 183.79,36.69 184.43,36.05 184.43,35.35 186.76,33.01 187.96,31.82 | 187.96,31.82 v187.77,31.63 | v127.64,62.18 127.64,62.28
  Bottom 0.305: U5C.10 191.6,43.78 192.15,44.32 197.61,44.32 198.12,43.81 198.12,40.47 198.05,40.4 196.38,40.4 195.77,39.79 195.77,36.54 194.33,35.11 191.25,35.11 v187.77,31.63 | v37.32,36.7 v39.5,36.7 | U2A.13 83.73,69.32 83.69,69.28 v83.69,69.1 | v127.64,62.18 127.64,59.79 U3B.10
A1  (via drill 0.38 pad 0.8)
  Top 0.305: ST1.03 189.77,11.87 191.74,13.85 191.74,15.9 191.25,16.39 189.63,16.39 188.69,17.33 188.69,18.67 189.21,19.19 189.21,31.27 184.92,35.55 184.92,36.31 184.59,36.64 v184.59,36.97 | U1E.9 42.11,35.58 43.19,36.66 46.19,36.66 v47.95,38.42 | v48.13,39.94 49.13,39.94 49.61,40.42 66.75,40.42 67.3,40.97 69.01,40.97 70.02,39.96 74.12,39.96 74.87,40.71 74.87,65.98 77.73,68.84 82.8,68.84 83.29,68.34 86.23,68.34 | 86.23,68.34 89.42,68.34 91.23,66.54 94.31,66.54 99.42,61.42 122.96,61.42 123.33,61.78 125.13,61.78 | 86.23,68.34 v86.23,68.57 | 125.13,61.78 U3B.9 | v183.03,36.97 183.02,36.97 182.8,36.74 178.81,36.74 178.01,35.94 168.82,35.94 164.55,40.21 156.58,40.21 155.44,41.35 155.44,42.51 149.72,48.23 149.72,51.72 149.22,52.23 149.22,54.1 148.25,55.07 148.25,56.91 143.57,61.58 143.43,61.58 141.28,63.73 140.45,63.73 140.3,63.88 130.86,63.88 128.4,61.42 127.16,61.42 126.8,61.78 125.13,61.78
  Bottom 0.305: U5C.9 189.06,39.73 186.08,36.75 185.2,36.75 185.11,36.83 184.65,36.83 | v47.95,38.42 48.13,38.61 v48.13,39.94 | U2A.12 86.27,68.61 v86.23,68.57 | v184.59,36.97 184.59,36.9 184.65,36.83 | 184.65,36.83 183.11,36.83 183.04,36.91 v183.04,36.96 v183.03,36.97
A2  (via drill 0.38 pad 0.8)
  Top 0.305: v50.34,36.4 50.34,35.99 44.07,29.72 35.44,29.72 34.49,28.77 U1E.3 | 88.76,69.99 89.17,69.99 91.64,67.52 94.71,67.52 99.83,62.41 122.56,62.41 | 88.76,69.99 77.49,69.99 73.89,66.39 73.89,41.12 73.71,40.94 70.43,40.94 69.42,41.95 66.89,41.95 66.34,41.4 50.68,41.4 v50.39,41.69 | ST1.04 192.31,18.27 191.25,19.32 191.25,29.91 185.41,35.76 185.41,37.51 185.17,37.75 | 122.56,62.41 122.56,62.67 v122.5,62.72 | 122.56,62.41 | 88.76,69.99 v88.76,69.59 | 122.56,62.41 123.08,62.93 128.52,62.93 130.45,64.87 140.71,64.87 140.86,64.72 141.69,64.72 143.84,62.57 143.98,62.57 149.23,57.32 149.23,55.49 150.2,54.52 150.2,52.63 150.7,52.13 150.7,48.64 156.54,42.8 156.54,41.64 156.98,41.19 164.96,41.19 169.23,36.92 177.6,36.92 178.4,37.73 182.03,37.73 182.51,38.22 183.55,38.22 184.04,37.73 184.66,37.73 184.68,37.75 185.17,37.75 | 185.17,37.75 185.34,37.58 185.44,37.58 v185.51,37.51
  Bottom 0.305: v50.39,41.69 50.39,36.44 v50.34,36.4 | v122.5,62.72 122.59,62.64 U3B.8 | U2A.11 88.81,69.64 v88.76,69.59 | v185.51,37.51 185.51,37.88 186.52,38.9 U5C.8
A3  (via drill 0.38 pad 0.8)
  Top 0.305: 191.75,23.5 191.75,19.52 192.8,18.47 192.8,13.26 194.85,11.21 ST1.05 | U5E.3 187.71,23.49 v187.71,23.5 | v192.66,23.5 191.75,23.5 | U2A.10 91.35,69.2 92.05,68.51 95.12,68.51 99.71,63.92 107.63,63.92 107.99,63.56 120.02,63.56 | v120.02,63.66 120.02,63.56 | 120.02,63.56 121.57,63.56 121.98,63.97 124.08,63.97 124.09,63.96 128.15,63.96 130.05,65.86 141.12,65.86 141.27,65.7 142.99,65.7 143.74,64.96 144.28,64.96 145.4,63.84 145.4,63.6 146.54,62.47 146.54,62.1 151.23,57.41 151.23,55.78 151.71,55.3 151.71,52.52 152.22,52.01 152.22,48.52 159.05,41.69 165.16,41.69 169.43,37.42 177.39,37.42 178.2,38.22 181.82,38.22 182.31,38.72 184.15,38.72 | 191.75,23.5 191.75,30.12 186.26,35.6 186.26,37.82 185.37,38.72 184.15,38.72 | v184.35,38.48 184.35,38.52 184.15,38.72
  Bottom 0.305: v187.71,23.5 v192.66,23.5 | U3B.7 120.05,63.52 120.02,63.56 v120.02,63.66 | U5C.7 183.98,38.72 184.22,38.49 184.34,38.49 v184.35,38.48
A4  (via drill 0.38 pad 0.8)
  Top 0.305: v92.84,69.34 94.98,69.34 99.92,64.41 107.83,64.41 108.08,64.17 115.25,64.17 115.39,64.31 v117.48,64.31 119.48,64.31 119.63,64.47 124.28,64.47 124.3,64.45 127.94,64.45 129.84,66.35 141.32,66.35 141.48,66.2 143.2,66.2 143.94,65.45 144.48,65.45 145.89,64.04 145.89,63.81 147.03,62.67 147.03,62.3 151.73,57.61 151.73,55.98 152.2,55.5 152.2,52.72 152.71,52.22 152.71,48.72 159.25,42.18 165.37,42.18 169.64,37.91 177.19,37.91 177.99,38.72 181.48,38.72 181.62,38.85 | 181.62,38.85 182.01,39.24 185.54,39.24 186.76,38.02 186.76,35.81 192.03,30.53 193.15,30.53 193.79,29.89 193.79,18.95 193.29,18.45 193.29,13.47 195.79,10.97 196.58,10.97 197.39,10.16 ST1.06 | v181.51,38.98 181.62,38.87 181.62,38.85
  Bottom 0.305: U5C.6 181.44,39.51 181.51,39.44 v181.51,38.98 | U2A.7 91.35,67.8 92.84,69.28 v92.84,69.34 | U3B.6 117.51,64.28 v117.48,64.31
A5  (via drill 0.38 pad 0.8)
  Top 0.305: v87.62,71.24 87.76,71.38 87.76,73.52 88.4,74.16 91.77,74.16 92.35,73.57 92.35,71.26 93.27,70.34 94.68,70.34 100.12,64.9 110.82,64.9 110.98,65.07 114.94,65.07 | 114.94,65.07 v114.94,64.92 | 114.94,65.07 124.37,65.07 124.5,64.94 127.74,64.94 129.64,66.84 141.53,66.84 141.68,66.69 143.4,66.69 144.14,65.95 144.69,65.95 146.39,64.25 146.39,64.01 147.52,62.88 147.52,62.51 152.22,57.81 152.22,56.19 152.7,55.71 152.7,52.92 153.2,52.42 153.2,48.93 159.45,42.67 165.57,42.67 169.84,38.4 176.99,38.4 177.79,39.21 178.88,39.21 | 178.88,39.21 180.31,39.21 180.83,39.73 185.75,39.73 187.25,38.23 187.25,36.01 192.23,31.02 193.35,31.02 194.29,30.09 194.29,18.74 193.79,18.24 193.79,13.8 196.13,11.46 198.95,11.46 199.93,10.48 ST1.07 | 178.88,39.21 v178.88,39.47
  Bottom 0.305: U2A.6 88.81,64.9 87.62,66.09 v87.62,71.24 | U3B.5 114.97,64.89 v114.94,64.92 | U5C.5 178.9,39.75 178.88,39.72 v178.88,39.47
A6  (via drill 0.38 pad 0.8)
  Top 0.305: ST1.08 202.47,9.49 200.01,11.95 196.36,11.95 194.28,14.03 194.28,18.04 196.33,20.09 196.33,29.89 195.75,30.47 194.83,30.47 193.78,31.52 192.44,31.52 187.74,36.21 187.74,38.43 185.95,40.23 178.1,40.23 176.77,38.9 176.36,38.9 | v84.96,71.25 84.96,73.41 86.21,74.65 91.97,74.65 92.89,73.73 92.89,71.42 93.48,70.83 94.89,70.83 100.32,65.4 110.6,65.4 111.02,65.82 v112.4,65.82 122.94,65.82 123.08,65.68 124.46,65.68 124.7,65.43 127.53,65.43 129.43,67.33 141.73,67.33 141.88,67.18 143.61,67.18 144.3,66.48 144.85,66.48 146.88,64.45 146.88,64.22 148.02,63.08 148.02,62.71 152.71,58.02 152.71,56.39 153.19,55.91 153.19,53.13 153.69,52.63 153.69,49.13 159.66,43.17 165.77,43.17 170.05,38.9 176.36,38.9 | v176.36,39.96 176.36,38.9
  Bottom 0.305: U2A.5 84.96,66.18 v84.96,71.25 | U3B.4 112.43,65.79 v112.4,65.82 | U5C.4 v176.36,39.96
A7  (via drill 0.38 pad 0.8)
  Top 0.305: ST1.09 205.01,10.13 202.69,12.45 196.56,12.45 194.77,14.23 194.77,17.83 196.83,19.89 196.83,30.09 195.95,30.96 195.03,30.96 193.98,32.01 192.64,32.01 188.24,36.42 188.24,38.64 186.16,40.72 175.13,40.72 174.43,40.72 173.87,40.72 173.82,40.77 | v82.42,71.25 82.42,73.27 84.3,75.14 95.22,75.14 96.36,74.01 96.36,71.04 98.13,69.27 98.59,69.27 99.08,68.78 99.08,68.3 101.48,65.89 109.27,65.89 109.96,66.58 109.98,66.58 | 109.98,66.58 122.93,66.58 123.34,66.17 124.67,66.17 124.91,65.93 127.33,65.93 129.23,67.83 141.94,67.83 142.09,67.67 143.81,67.67 144.51,66.98 145.05,66.98 147.37,64.66 147.37,64.42 148.51,63.28 148.51,62.92 153.2,58.22 153.2,56.59 153.68,56.12 153.68,53.33 154.19,52.83 154.19,49.34 159.48,44.04 169.16,44.04 169.75,43.45 169.75,40 170.36,39.39 172.97,39.39 173.82,40.24 173.82,40.77 | 109.98,66.58 v110.16,66.41 | U5C.3 173.82,40.77
  Bottom 0.305: v82.42,71.25 82.42,66.18 U2A.4 | U3B.3 109.89,66.14 v110.16,66.41
A8  (via drill 0.38 pad 0.8)
  Top 0.305: v208.44,12.32 208.44,9.43 207.55,8.54 ST1.10 | v208.83,17.24 208.83,17.3 208.67,17.46 208.67,27.65 203.74,32.58 199.1,32.58 198.19,33.49 193.25,33.49 189.97,36.77 189.97,41.21 190.06,41.3 190.06,44.29 190.37,44.6 190.37,46.36 189.31,47.42 186,47.42 183.1,50.32 177.1,50.32 176.89,50.54 176.33,50.54 | U2B.5 87.79,53.5 88.27,53.98 90.42,53.98 91.34,54.89 91.34,58.14 90.93,58.55 83.38,58.55 82.42,59.51 82.42,64.77 | v79.87,71.26 79.81,71.32 79.81,73.19 82.25,75.64 95.43,75.64 96.85,74.21 96.85,71.24 98.33,69.76 98.79,69.76 99.57,68.99 99.57,68.5 101.69,66.38 109.06,66.38 109.84,67.16 123.11,67.16 123.61,66.66 124.87,66.66 125.11,66.42 127.12,66.42 129.03,68.32 142.14,68.32 142.29,68.17 144.01,68.17 144.71,67.47 145.25,67.47 147.86,64.86 147.86,64.62 149,63.49 149,63.12 154.72,57.41 154.72,53.69 156.44,51.97 158.4,51.97 158.66,51.71 164.83,51.71 166,50.54 176.33,50.54 | 82.42,64.77 82.42,66.04 81.39,67.08 v80.93,67.08 | U2A.3 82.32,64.88 82.42,64.77 | 176.33,50.54 v176.33,50.62
  Bottom 0.305: v208.83,17.24 208.83,12.71 v208.44,12.32 | v79.87,71.26 79.87,68.25 80.93,67.18 v80.93,67.08 | U5C.25 176.36,51.05 176.33,51.02 v176.33,50.62
A9  (via drill 0.38 pad 0.8)
  Top 0.305: ST1.11 210.09,10.8 v209.22,11.68 | 78.87,64.66 U2A.2 | 78.87,64.66 78.87,53.85 80.17,52.54 U2B.2 | 78.87,64.66 78.87,67.44 v78.36,67.94 | v77.95,70.75 77.65,71.05 77.65,74.09 79.68,76.13 95.63,76.13 97.34,74.42 97.34,71.45 98.54,70.26 99,70.26 100.06,69.19 100.06,68.7 101.89,66.87 108.86,66.87 109.81,67.83 123.55,67.83 123.89,68.17 124.75,68.17 125.52,67.41 126.72,67.41 128.62,69.31 142.55,69.31 142.7,69.15 144.42,69.15 145.12,68.45 145.75,68.45 148.4,65.81 148.81,65.81 149.49,65.13 149.49,63.33 155.21,57.61 155.21,53.9 156.64,52.47 158.61,52.47 158.87,52.2 165.03,52.2 166.2,51.03 175.6,51.03 176.09,51.52 178.95,51.52 | v209.92,16.63 209.59,16.96 209.59,17.62 209.16,18.04 209.16,27.85 203.94,33.07 199.3,33.07 198.4,33.98 193.46,33.98 190.47,36.98 190.47,41.01 190.56,41.1 190.56,44.09 190.87,44.4 190.87,46.56 189.52,47.92 186.2,47.92 183.3,50.81 182.04,50.81 181.33,51.52 178.95,51.52 | 178.95,51.52 178.95,51.12 v178.99,51.08
  Bottom 0.305: v209.22,11.68 209.59,12.04 209.59,16.29 v209.92,16.63 | v78.36,67.94 78.36,70.34 v77.95,70.75 | U5C.24 178.9,51.16 v178.99,51.08
A10  (via drill 0.38 pad 0.8)
  Top 0.305: R10.P$1 210.64,21.39 210.64,18.65 212.63,16.66 v212.63,16.4 | ST1.12 212.63,11.82 v212.6,11.85
  Bottom 0.305: v212.63,16.4 212.6,16.36 v212.6,11.85
D0  (via drill 0.38 pad 0.8)
  Top 0.305: U4E.2 145.3,20.96 142.88,18.54 122.5,18.54 122.15,18.19 117.04,18.19 116.77,17.93 116.15,17.93 115.88,18.19 113.23,18.19 | 9.81,38.99 v8.79,38.99 | 9.81,38.99 9.81,55.33 19.57,65.08 38.33,65.08 39.69,63.72 v42.57,63.72 | 113.23,18.19 111.61,16.57 107.19,16.57 106.4,17.36 102.18,17.36 100.34,15.52 100.34,12.74 96.64,9.04 45.77,9.04 43.74,11.08 18.08,11.08 9.81,19.35 9.81,38.99 | 113.23,18.19 113.23,17.85 v113.24,17.83 | U3B.11 130.21,61.03 131.58,62.41 139.69,62.41 139.84,62.25 139.92,62.25 141.65,60.53 142.35,60.53 142.71,60.16 144.29,60.16 146.73,57.72 146.73,54.68 147.2,54.21 147.2,53.98 | U5C.11 194.14,45.38 189.86,49.66 v188.59,49.66 | v156.08,55.12 156.08,53.72 156.84,52.96 158.81,52.96 159.07,52.7 165.24,52.7 166.41,51.52 175.4,51.52 175.89,52.02 181.54,52.02 182.25,51.31 184.63,51.31 186,49.94 186.02,49.94 v186.31,49.66 | 147.2,53.98 147.2,50.59 146.73,50.11 146.73,47.36 v150.63,43.46 | U5A.1 160.45,59.88 v160.34,59.76 | v147.36,53.99 147.34,53.98 147.2,53.98 | v17.79,38.9 17.81,38.88 27.05,38.88 27.76,39.59 U1C.3
  Bottom 0.305: v8.79,38.99 17.79,38.99 v17.79,38.9 | U3E.18 113.9,26.27 112.9,25.27 112.9,18.15 113.22,17.83 v113.24,17.83 | 155.72,55.49 157.35,57.12 157.65,57.12 158.45,57.91 158.86,57.91 160.34,59.39 v160.34,59.76 | 155.72,55.49 155.08,54.85 153.29,54.85 152.18,53.74 150.35,53.74 149.87,54.22 147.59,54.22 v147.36,53.99 | v150.63,43.46 150.51,43.35 150.38,43.35 149.05,42.02 149.05,35.22 147.54,33.71 147.54,31.21 146.46,30.12 146.46,23.65 145.3,22.49 U4E.2 | v188.59,49.66 v186.31,49.66 | v156.08,55.12 155.72,55.49 | RP1.8 40.46,55.76 42.56,57.85 42.56,63.58 42.57,63.6 v42.57,63.72
D1  (via drill 0.38 pad 0.8)
  Top 0.305: U4E.3 147.84,23.34 | 26.42,52.83 26.42,53.98 25.92,54.47 19.88,54.47 19.12,53.72 19.06,53.72 v18.81,53.47 | RP1.2 25.25,52.83 26.42,52.83 | v10.62,54.29 10.62,53.92 10.35,53.65 10.35,19.51 18.29,11.57 43.94,11.57 45.97,9.54 96.44,9.54 99.84,12.94 99.84,17.95 101.29,19.4 102.21,19.4 102.77,18.84 107.01,18.84 107.8,18.05 111,18.05 112.86,19.91 112.86,22.22 113.49,22.85 115.18,22.85 | U1C.5 32.84,43.87 32.12,44.59 26.97,44.59 26.42,45.15 26.42,52.83 | v115.18,21.72 115.18,22.85 | 147.84,23.34 124.81,23.34 124.31,22.85 115.18,22.85 | v148.59,23.37 148.57,23.34 147.84,23.34 | U3B.12 132.75,61.54 133.12,61.91 139.49,61.91 139.64,61.76 139.72,61.76 141.45,60.03 142.14,60.03 142.5,59.67 144.09,59.67 145.02,58.74 145.02,57.29 | U5A.40 162.5,75.12 162,74.62 v157.36,74.62 | 145.02,57.29 v145.52,57.29 | 145.02,57.29 145.02,55.7 146.45,54.27 146.45,50.53 146.24,50.32 146.24,46.78 v150.56,42.46 | U5C.12 196.68,44.23 193.8,47.11 193.8,48.01 191,50.81 189.21,50.81 189.11,50.91 189.09,50.91 v188.83,51.17 | v148.72,68.58 149.7,67.6 149.7,67.06 150.42,66.34 150.42,63.09 155.7,57.81 155.7,56.96 156.84,55.82 156.84,54.12 157.49,53.47 158.99,53.47 159.28,53.19 165.44,53.19 166.61,52.02 175.19,52.02 175.69,52.51 181.74,52.51 182.45,51.8 184.86,51.8 185.96,50.7 v186.31,50.7
  Bottom 0.305: U3E.17 116.44,26.18 115.18,24.91 v115.18,21.72 | v10.62,54.29 11.45,53.47 v18.81,53.47 | v148.59,23.37 149.22,24 149.22,30.73 149.54,31.05 149.54,41.52 150.37,42.34 150.44,42.34 v150.56,42.46 | v145.52,57.29 145.52,57.72 146.99,59.19 146.99,67.22 148.62,68.85 | v148.72,68.58 148.72,68.75 148.62,68.85 | 148.62,68.85 151.36,68.85 152.36,69.85 153.69,69.85 154.42,70.58 154.42,71.68 v157.36,74.62 | v188.83,51.17 188.81,51.17 188.34,50.7 v186.31,50.7
D2  (via drill 0.38 pad 0.8)
  Top 0.305: U4E.4 150.38,23.84 | U1C.7 37.97,41.21 37.97,44.96 37.3,45.64 29.04,45.64 28.81,45.87 28.81,52.81 | RP1.3 28.81,52.81 | 124.08,24.16 v124.08,23.72 | v18.81,54.47 19.06,54.72 19.12,54.72 19.37,54.96 28.43,54.96 28.81,54.59 28.81,52.81 | v11.63,54.6 11.63,54.23 10.84,53.44 10.84,19.71 18.49,12.06 44.14,12.06 46.18,10.03 96.23,10.03 99.35,13.14 99.35,18.16 101.08,19.89 102.42,19.89 102.98,19.33 107.21,19.33 108,18.54 110.79,18.54 112.37,20.11 112.37,22.42 113.29,23.34 122.32,23.34 123.13,24.16 124.08,24.16 | 124.08,24.16 124.76,24.16 125.08,23.84 147.99,23.84 148.28,24.12 148.9,24.12 149.19,23.84 150.38,23.84 | 150.38,23.84 151.22,23.84 151.24,23.86 v151.38,23.86 | U3B.13 136.95,61.42 139.28,61.42 139.44,61.27 139.51,61.27 141.24,59.54 141.94,59.54 142.3,59.18 143.88,59.18 144.44,58.62 144.44,57.22 | U5A.39 163.94,73.87 156.88,73.87 156.36,74.4 v156.36,74.79 | U5C.13 199.19,42.41 199.19,44.67 198.26,45.61 196.7,45.61 194.79,47.52 194.79,48.72 191.6,51.91 190.22,51.91 v189.62,52.51 | 144.44,57.22 144.37,57.15 v144.21,57.15 | 145.68,53.92 144.44,55.15 144.44,57.22 | 145.68,53.92 145.69,53.94 v145.69,53.95 | v150.55,41.46 150.49,41.46 149.8,42.15 149.8,42.44 145.74,46.5 145.74,53.85 145.68,53.92 | v185.97,51.76 185.6,51.76 185.07,52.29 182.65,52.29 181.94,53 175.48,53 174.99,52.51 166.82,52.51 165.64,53.68 159.48,53.68 159.2,53.97 158.31,53.97 v157.59,54.68
  Bottom 0.305: U3E.14 124.06,23.73 v124.08,23.72 | v18.81,54.47 18.56,54.47 18.43,54.6 v11.63,54.6 | v151.38,23.86 151.38,30 150.08,31.3 150.08,40.99 150.54,41.46 v150.55,41.46 | v144.21,57.15 146.5,59.44 146.5,67.43 148.41,69.34 151.15,69.34 152.16,70.34 153.48,70.34 153.92,70.79 153.92,72.23 154.3,72.6 154.3,72.73 v156.36,74.79 | v145.69,53.95 146.12,53.95 147.65,52.42 148.28,52.42 148.61,52.76 152.58,52.76 153.7,53.87 156.6,53.87 157.41,54.68 v157.59,54.68 | v189.62,52.51 189.04,51.92 188.49,51.92 188.33,51.76 v185.97,51.76
D3  (via drill 0.38 pad 0.8)
  Top 0.305: U1C.9 43,45.65 42.52,46.13 32.42,46.13 31.35,47.2 31.35,52.83 | RP1.4 30.33,52.83 31.35,52.83 | v12.26,55.38 12.38,55.26 12.38,54.29 11.33,53.24 11.33,19.92 18.7,12.55 44.35,12.55 46.38,10.52 96.03,10.52 98.86,13.35 98.86,18.36 100.88,20.38 102.62,20.38 103.18,19.82 107.42,19.82 108.2,19.04 109.44,19.04 110.36,19.96 110.36,22.39 111.81,23.84 122.11,23.84 123.13,24.86 126.54,24.86 | v18.81,55.47 28.5,55.47 28.53,55.5 29.88,55.5 31.35,54.03 31.35,52.83 | 126.54,24.86 127.06,24.33 147.79,24.33 148.07,24.62 152.92,24.62 | 126.54,24.86 v126.54,24.91 | U5A.38 165.98,73.37 156.54,73.37 155.35,74.56 v155.35,74.86 | U5C.15 201.76,54.19 201.09,53.52 v190.03,53.52 | U4E.5 152.92,24.62 | 152.92,24.62 153.66,24.62 v153.92,24.35 | 158.05,57.53 158.35,57.53 158.72,57.16 v158.76,57.16 | 158.05,57.53 158.05,58.18 158.14,58.28 158.14,58.9 157.66,59.38 157,59.38 152.39,63.99 152.39,67.16 151.67,67.88 151.67,69.89 150.55,71 | v151.94,41.95 151.94,43.22 147.22,47.94 147.22,49.91 147.71,50.4 147.71,52.93 v147.97,53.18 | v186.23,52.76 186.23,52.89 186.23,53.52 185.32,54.44 184.61,54.44 184.07,54.97 174.66,54.97 174.17,54.48 167.63,54.48 166.46,55.65 161.36,55.65 160.15,56.86 159.25,56.86 159.22,56.9 158.68,56.9 158.05,57.53 | U3B.15 144.19,75 146.5,72.7 148.05,72.7 149.28,71.46 149.74,71.46 150.2,71.01 150.55,71.01 150.55,71 | 150.55,71 v150.55,70.74
  Bottom 0.305: v12.26,55.38 12.35,55.47 v18.81,55.47 | U3E.13 126.6,24.98 v126.54,24.91 | v153.92,24.35 153.92,30.13 152.31,31.74 152.31,41.32 151.94,41.7 v151.94,41.95 | v147.97,53.18 148.04,53.25 152.38,53.25 153.49,54.36 156.39,54.36 156.84,54.8 156.84,55.24 v158.76,57.16 | v190.03,53.52 190.01,53.5 189.55,53.5 188.8,52.76 v186.23,52.76 | v155.35,74.86 155.1,74.62 155.1,74.33 153.81,73.04 153.81,72.81 152.5,71.5 151.31,71.5 v150.55,70.74
D4  (via drill 0.38 pad 0.8)
  Top 0.305: U1C.12 43,47.83 41.8,46.62 32.62,46.62 31.84,47.41 31.84,52.83 | RP1.5 31.86,52.81 31.84,52.83 | v19.05,56.48 19.53,55.99 30.08,55.99 31.84,54.23 31.84,52.83 | v12.75,56.31 13.02,56.05 13.02,54.22 11.83,53.03 11.83,20.12 18.9,13.05 44.55,13.05 46.59,11.01 95.83,11.01 98.37,13.55 98.37,18.57 100.68,20.87 102.83,20.87 103.38,20.32 107.62,20.32 108.41,19.53 109.24,19.53 109.83,20.11 109.83,22.55 111.6,24.33 121.91,24.33 122.93,25.35 125.51,25.35 125.95,25.79 127.44,25.79 | 127.44,25.79 v127.44,25.69 | 127.44,25.79 128.21,25.79 129.17,24.82 147.58,24.82 147.87,25.11 155.46,25.11 | U5C.16 199.22,54.95 198.78,54.51 v190.05,54.51 v190.05,54.52 | U3B.16 135.29,73.86 135.8,73.34 141.76,73.34 142.17,73.75 144.75,73.75 146.3,72.2 147.84,72.2 149.08,70.97 149.24,70.97 149.9,70.31 | U5A.37 168.03,72.88 156.33,72.88 155.11,74.11 154.95,74.11 154.35,74.71 v154.35,74.86 | U4E.6 155.46,25.11 | 155.46,25.11 156.25,25.11 v156.46,24.89 | v147.49,54.99 147.62,54.99 148.72,53.89 148.72,51.02 148.21,50.5 148.21,50.2 147.71,49.7 147.71,48.14 152.94,42.91 v152.94,41.95 | 157.18,58.5 157.51,58.18 157.51,57.34 158.56,56.29 160.03,56.29 161.16,55.16 166.26,55.16 167.43,53.99 174.38,53.99 174.87,54.48 183.87,54.48 184.41,53.94 184.79,53.94 185.23,53.5 185.23,53.45 v185.37,53.32 | 157.18,58.5 151.9,63.78 151.9,66.95 151.18,67.68 151.18,69.03 149.9,70.31 | 157.18,58.5 157.27,58.5 v157.37,58.61 | 149.9,70.31 149.9,70.33 149.59,70.64 v149.5,70.64
  Bottom 0.305: U3E.8 126.6,23.63 127.42,24.45 127.42,25.67 v127.44,25.69 | v12.75,56.31 12.88,56.44 13.6,56.44 13.64,56.48 v19.05,56.48 | v156.46,24.89 156.46,30.13 154.88,31.72 154.88,33.45 152.96,35.37 152.96,41.93 v152.94,41.95 | v147.49,54.99 150.3,54.99 150.56,55.25 151.39,55.25 151.98,55.84 154.65,55.84 157.37,58.56 v157.37,58.61 | v185.37,53.32 185.45,53.32 185.88,53.75 188.98,53.75 189.74,54.51 190.04,54.51 v190.05,54.52 | v154.35,74.86 153.59,74.11 153.59,73.52 153.31,73.24 153.31,73.01 152.29,71.99 150.73,71.99 149.76,71.03 149.76,70.91 v149.5,70.64
D5  (via drill 0.38, 0.38 pad 0.8)
  Top 0.305: U1C.14 37.71,48.78 36.45,50.04 36.45,52.83 | 36.45,52.83 36.45,54.99 35.97,55.47 31.82,55.47 30.8,56.49 20.44,56.49 19.44,57.48 v19.09,57.48 | RP1.6 35.41,52.83 36.45,52.83 | v13.29,57.2 13.51,56.97 13.51,54.02 12.32,52.83 12.32,20.32 19.1,13.54 44.76,13.54 46.79,11.51 95.62,11.51 97.87,13.76 97.87,18.77 100.47,21.37 103.03,21.37 103.59,20.81 107.13,20.81 107.61,21.29 107.61,22.14 108.32,22.85 109.43,22.85 111.4,24.82 121.7,24.82 123.33,26.45 124.97,26.45 | 158,25.67 147.73,25.67 147.38,25.32 129.37,25.32 128.24,26.45 124.97,26.45 | U3B.17 132.75,73.48 133.38,72.85 141.97,72.85 142.38,73.25 144.55,73.25 146.09,71.71 146.72,71.71 147.09,71.35 147.65,71.35 | U5A.36 170.08,72.39 156.13,72.39 155.25,73.27 154.88,73.27 153.41,74.74 v151.43,74.74 | U5C.17 196.68,55.84 196.11,55.27 v190.72,55.27 | U4E.7 158,25.67 | 158,25.67 158.86,25.67 v159.13,25.4 | v153.95,42.21 153.95,42.61 148.21,48.35 148.21,49.5 148.9,50.19 v148.96,50.19 | 159.13,55.48 158.64,55.48 157.01,57.1 157.01,57.9 151.41,63.5 151.41,66.75 150.68,67.47 150.68,68.38 147.72,71.35 147.65,71.35 | v159.15,55.53 159.15,55.5 159.13,55.48 | 147.65,71.35 v147.65,71.32 | 159.13,55.48 160.14,55.48 160.95,54.67 166.05,54.67 167.22,53.49 174.58,53.49 175.07,53.99 183.65,53.99 184.36,53.28 v184.36,53.19 | v124.97,26.19 124.97,26.45
  Bottom 0.305: U3E.7 124.06,22.64 124.97,23.54 v124.97,26.19 | v19.09,57.48 18.61,57.48 18.42,57.3 13.39,57.3 v13.29,57.2 | v159.13,25.4 159,25.53 159,30.13 157.44,31.69 157.44,33.94 157.09,34.3 154.94,34.3 153.46,35.77 153.46,41.37 153.95,41.86 v153.95,42.21 | v190.72,55.27 190.37,55.27 190.36,55.27 189.74,55.27 189.29,54.83 189.29,54.76 188.77,54.24 185.22,54.24 184.61,53.63 184.61,53.43 v184.36,53.19 | v159.15,55.53 158.84,55.22 158.84,52.12 156.69,49.97 155.61,49.97 154.86,50.72 149.84,50.72 149.31,50.19 v148.96,50.19 | v147.65,71.32 147.92,71.59 148.37,71.59 149.75,72.98 151.89,72.98 152.08,73.17 152.08,74.09 v151.43,74.74
D6  (via drill 0.38 pad 0.8)
  Top 0.305: v144.04,21.34 144.04,20.39 142.68,19.04 122.3,19.04 121.95,18.68 v116.46,18.68 113.03,18.68 111.41,17.07 107.39,17.07 106.6,17.85 101.97,17.85 101.41,17.29 v100.65,17.29 | U1C.16 32.84,48.06 33.78,47.12 38.35,47.12 38.99,47.75 38.99,50.04 38.23,50.8 37.34,50.8 36.96,51.18 36.96,52.83 | RP1.7 36.98,52.81 36.96,52.83 | v19.94,58.05 20.37,58.05 21.44,56.98 31,56.98 32.02,55.96 36.18,55.96 36.96,55.18 36.96,52.83 | v13.85,58.05 14.04,57.86 14.04,53.86 12.81,52.63 12.81,20.53 19.31,14.03 44.96,14.03 46.99,12 95.42,12 97.38,13.96 97.38,19.35 v98.96,20.93 v98.97,20.93 | 160.54,26.16 144.13,26.16 v144.13,26.07 | U3B.18 130.21,73.09 130.95,72.35 142.17,72.35 142.58,72.76 144.34,72.76 147.24,69.87 147.62,69.87 | U5A.35 172.12,71.9 155.93,71.9 155.05,72.77 154.65,72.77 153.59,73.83 v152.84,73.83 | U4E.8 160.54,26.16 | 160.54,26.16 160.91,26.16 v161.54,25.53 | 159.51,54.72 158.63,54.72 156.52,56.84 156.52,57.69 150.91,63.3 150.91,66.55 150.19,67.27 150.19,68.17 148.5,69.87 147.62,69.87 | v154.68,41.52 154.7,41.54 154.7,42.55 149.23,48.02 149.23,48.92 v148.96,49.19 | v188.54,55.07 188.46,54.99 189.38,54.99 190.41,56.02 191.03,56.02 191.1,55.96 192.48,55.96 U5C.18 | 159.51,54.72 v159.63,54.6 | v147.62,70.32 147.62,69.87 | 159.51,54.72 160.2,54.72 160.75,54.17 165.85,54.17 167.02,53 174.78,53 175.28,53.49 183.07,53.49 v183.35,53.22
  Bottom 0.305: v144.13,26.07 144.04,25.98 v144.04,21.34 | v19.94,58.05 19.76,58.24 14.54,58.24 14.35,58.05 v13.85,58.05 | v98.97,20.93 100.11,19.79 100.11,17.84 v100.65,17.29 | U3E.4 116.44,18.7 v116.46,18.68 | v161.54,25.53 161.54,30.25 160.24,31.56 160.24,33.18 158.63,34.79 155.14,34.79 153.95,35.98 153.95,40.41 154.68,41.14 v154.68,41.52 | v188.54,55.07 188.42,54.96 185.94,54.96 185.73,54.74 184.41,54.74 183.16,53.49 183.16,53.43 v183.35,53.23 v183.35,53.22 | v159.63,54.6 159.35,54.32 159.35,51.94 156.89,49.48 155.4,49.48 154.65,50.23 150.18,50.23 149.14,49.19 v148.96,49.19 | v147.62,70.32 147.87,70.56 148.03,70.56 149.95,72.48 152.09,72.48 152.82,73.22 152.82,73.82 v152.84,73.83
D7  (via drill 0.38 pad 0.8)